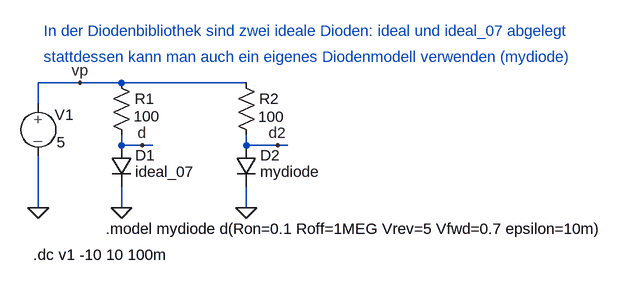
[diagram p0: schematic ideale_diode.asc]
ideale_diode.asc, the LTspice schematic file:
Version 4
SHEET 1 1228 680
WIRE 128 16 64 16
WIRE 192 16 128 16
WIRE 384 16 192 16
WIRE 64 48 64 16
WIRE 192 112 192 96
WIRE 224 112 192 112
WIRE 240 112 224 112
WIRE 384 112 384 96
WIRE 432 112 384 112
WIRE 448 112 432 112
WIRE 64 208 64 128
WIRE 192 208 192 176
WIRE 384 208 384 176
FLAG 192 208 0
FLAG 64 208 0
FLAG 128 16 vp
FLAG 224 112 d
FLAG 384 208 0
FLAG 432 112 d2
SYMBOL diode 176 112 R0
WINDOW 0 37 15 Left 0
WINDOW 3 37 41 Left 0
SYMATTR InstName D1
SYMATTR Value ideal_07
SYMBOL res 176 0 R0
WINDOW 3 35 67 Left 0
SYMATTR Value 100
SYMATTR InstName R1
SYMBOL Source-V 64 32 R0
WINDOW 0 25 33 Left 0
WINDOW 3 28 75 Left 0
WINDOW 123 0 0 Left 0
WINDOW 39 0 0 Left 0
SYMATTR InstName V1
SYMATTR Value 5
SYMBOL diode 368 112 R0
WINDOW 0 37 15 Left 0
WINDOW 3 37 41 Left 0
SYMATTR InstName D2
SYMATTR Value mydiode
SYMBOL res 368 0 R0
WINDOW 3 34 68 Left 0
SYMATTR Value 100
SYMATTR InstName R2
TEXT 168 240 Left 0 !.model mydiode d(Ron=0.1 Roff=1MEG Vrev=5 Vfwd=0.7 epsilon=10m)
TEXT 56 280 Left 0 !.dc v1 -10 10 100m
TEXT 72 -64 Left 0 ;In der Diodenbibliothek sind zwei ideale Dioden: ideal und ideal_07 abgelegt
TEXT 72 -24 Left 0 ;stattdessen kann man auch ein eigenes Diodenmodell verwenden (mydiode)

The netlist it stands for:
* ideale_diode.asc
D1 d 0 ideal_07
R1 vp d 100
V1 vp 0 5
D2 d2 0 mydiode
R2 vp d2 100
.model D D
.lib standard.dio
.model mydiode d(Ron=0.1 Roff=1MEG Vrev=5 Vfwd=0.7 epsilon=10m)
.dc v1 -10 10 100m
* In der Diodenbibliothek sind zwei ideale Dioden: ideal und ideal_07 abgelegt
* stattdessen kann man auch ein eigenes Diodenmodell verwenden (mydiode)
.backanno
.end